# Altium project TestNumPad_r1.PrjPCB
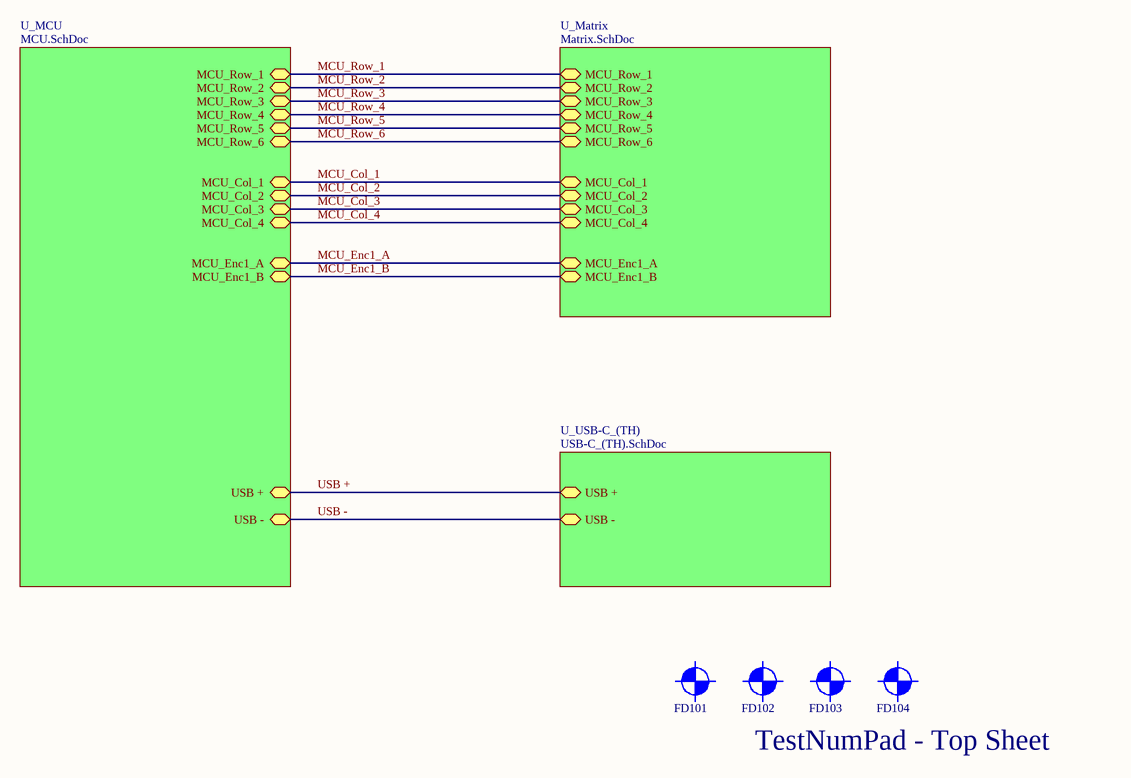
[diagram p0: Top Sheet.SchDoc]
DrawnBy: JimBobJones; Rev: r1
4 sheets, 98 parts. Net scope: hierarchical (ports join the sheet entries above them; power ports are global).
Board file: TestNumPad_r1.PcbDoc
Sheets:
  Top Sheet.SchDoc
    U_MCU = MCU.SchDoc
    U_Matrix = Matrix.SchDoc
    U_USB-C_(TH) = USB-C_(TH).SchDoc

## Sheet Top Sheet.SchDoc
size A4; DrawnBy: JimBobJones; DocumentNumber: 1; SheetNumber: 1; SheetTotal: 4

### Parts
FD101  Fiducial  [Fiducial]  (value not drawn)  (no BOM)
FD102  Fiducial  [Fiducial]  (value not drawn)  (no BOM)
FD103  Fiducial  [Fiducial]  (value not drawn)  (no BOM)
FD104  Fiducial  [Fiducial]  (value not drawn)  (no BOM)

### Sub-sheets
U_Matrix = Matrix.SchDoc: MCU_Row_1 (bidir), MCU_Row_2 (bidir), MCU_Row_3 (bidir), MCU_Row_4 (bidir), MCU_Row_5 (bidir), MCU_Row_6 (bidir), MCU_Col_1 (bidir), MCU_Col_2 (bidir), MCU_Col_3 (bidir), MCU_Col_4 (bidir), MCU_Enc1_A (bidir), MCU_Enc1_B (bidir)
U_MCU = MCU.SchDoc: MCU_Row_1 (bidir), MCU_Row_2 (bidir), MCU_Row_3 (bidir), MCU_Row_4 (bidir), MCU_Row_5 (bidir), MCU_Row_6 (bidir), MCU_Col_1 (bidir), MCU_Col_2 (bidir), MCU_Col_3 (bidir), MCU_Col_4 (bidir), MCU_Enc1_A (bidir), MCU_Enc1_B (bidir), USB - (bidir), USB + (bidir)
U_USB-C_(TH) = USB-C_(TH).SchDoc: USB - (bidir), USB + (bidir)

### Nets
MCU_Col_1: sheet U_MCU/MCU_Col_1, sheet U_Matrix/MCU_Col_1
MCU_Col_2: sheet U_MCU/MCU_Col_2, sheet U_Matrix/MCU_Col_2
MCU_Col_3: sheet U_MCU/MCU_Col_3, sheet U_Matrix/MCU_Col_3
MCU_Col_4: sheet U_MCU/MCU_Col_4, sheet U_Matrix/MCU_Col_4
MCU_Enc1_A: sheet U_MCU/MCU_Enc1_A, sheet U_Matrix/MCU_Enc1_A
MCU_Enc1_B: sheet U_MCU/MCU_Enc1_B, sheet U_Matrix/MCU_Enc1_B
MCU_Row_1: sheet U_MCU/MCU_Row_1, sheet U_Matrix/MCU_Row_1
MCU_Row_2: sheet U_MCU/MCU_Row_2, sheet U_Matrix/MCU_Row_2
MCU_Row_3: sheet U_MCU/MCU_Row_3, sheet U_Matrix/MCU_Row_3
MCU_Row_4: sheet U_MCU/MCU_Row_4, sheet U_Matrix/MCU_Row_4
MCU_Row_5: sheet U_MCU/MCU_Row_5, sheet U_Matrix/MCU_Row_5
MCU_Row_6: sheet U_MCU/MCU_Row_6, sheet U_Matrix/MCU_Row_6
USB +: sheet U_MCU/USB +, sheet U_USB-C_(TH)/USB +
USB -: sheet U_MCU/USB -, sheet U_USB-C_(TH)/USB -

### Notes on the sheet
- TestNumPad - Top Sheet

### Library data of the parts
FD101-FD104 = Fiducial: Fiducial Mark

## Sheet MCU.SchDoc
size A3; DrawnBy: JimBobJones; DocumentNumber: 3; SheetNumber: 3; SheetTotal: 4
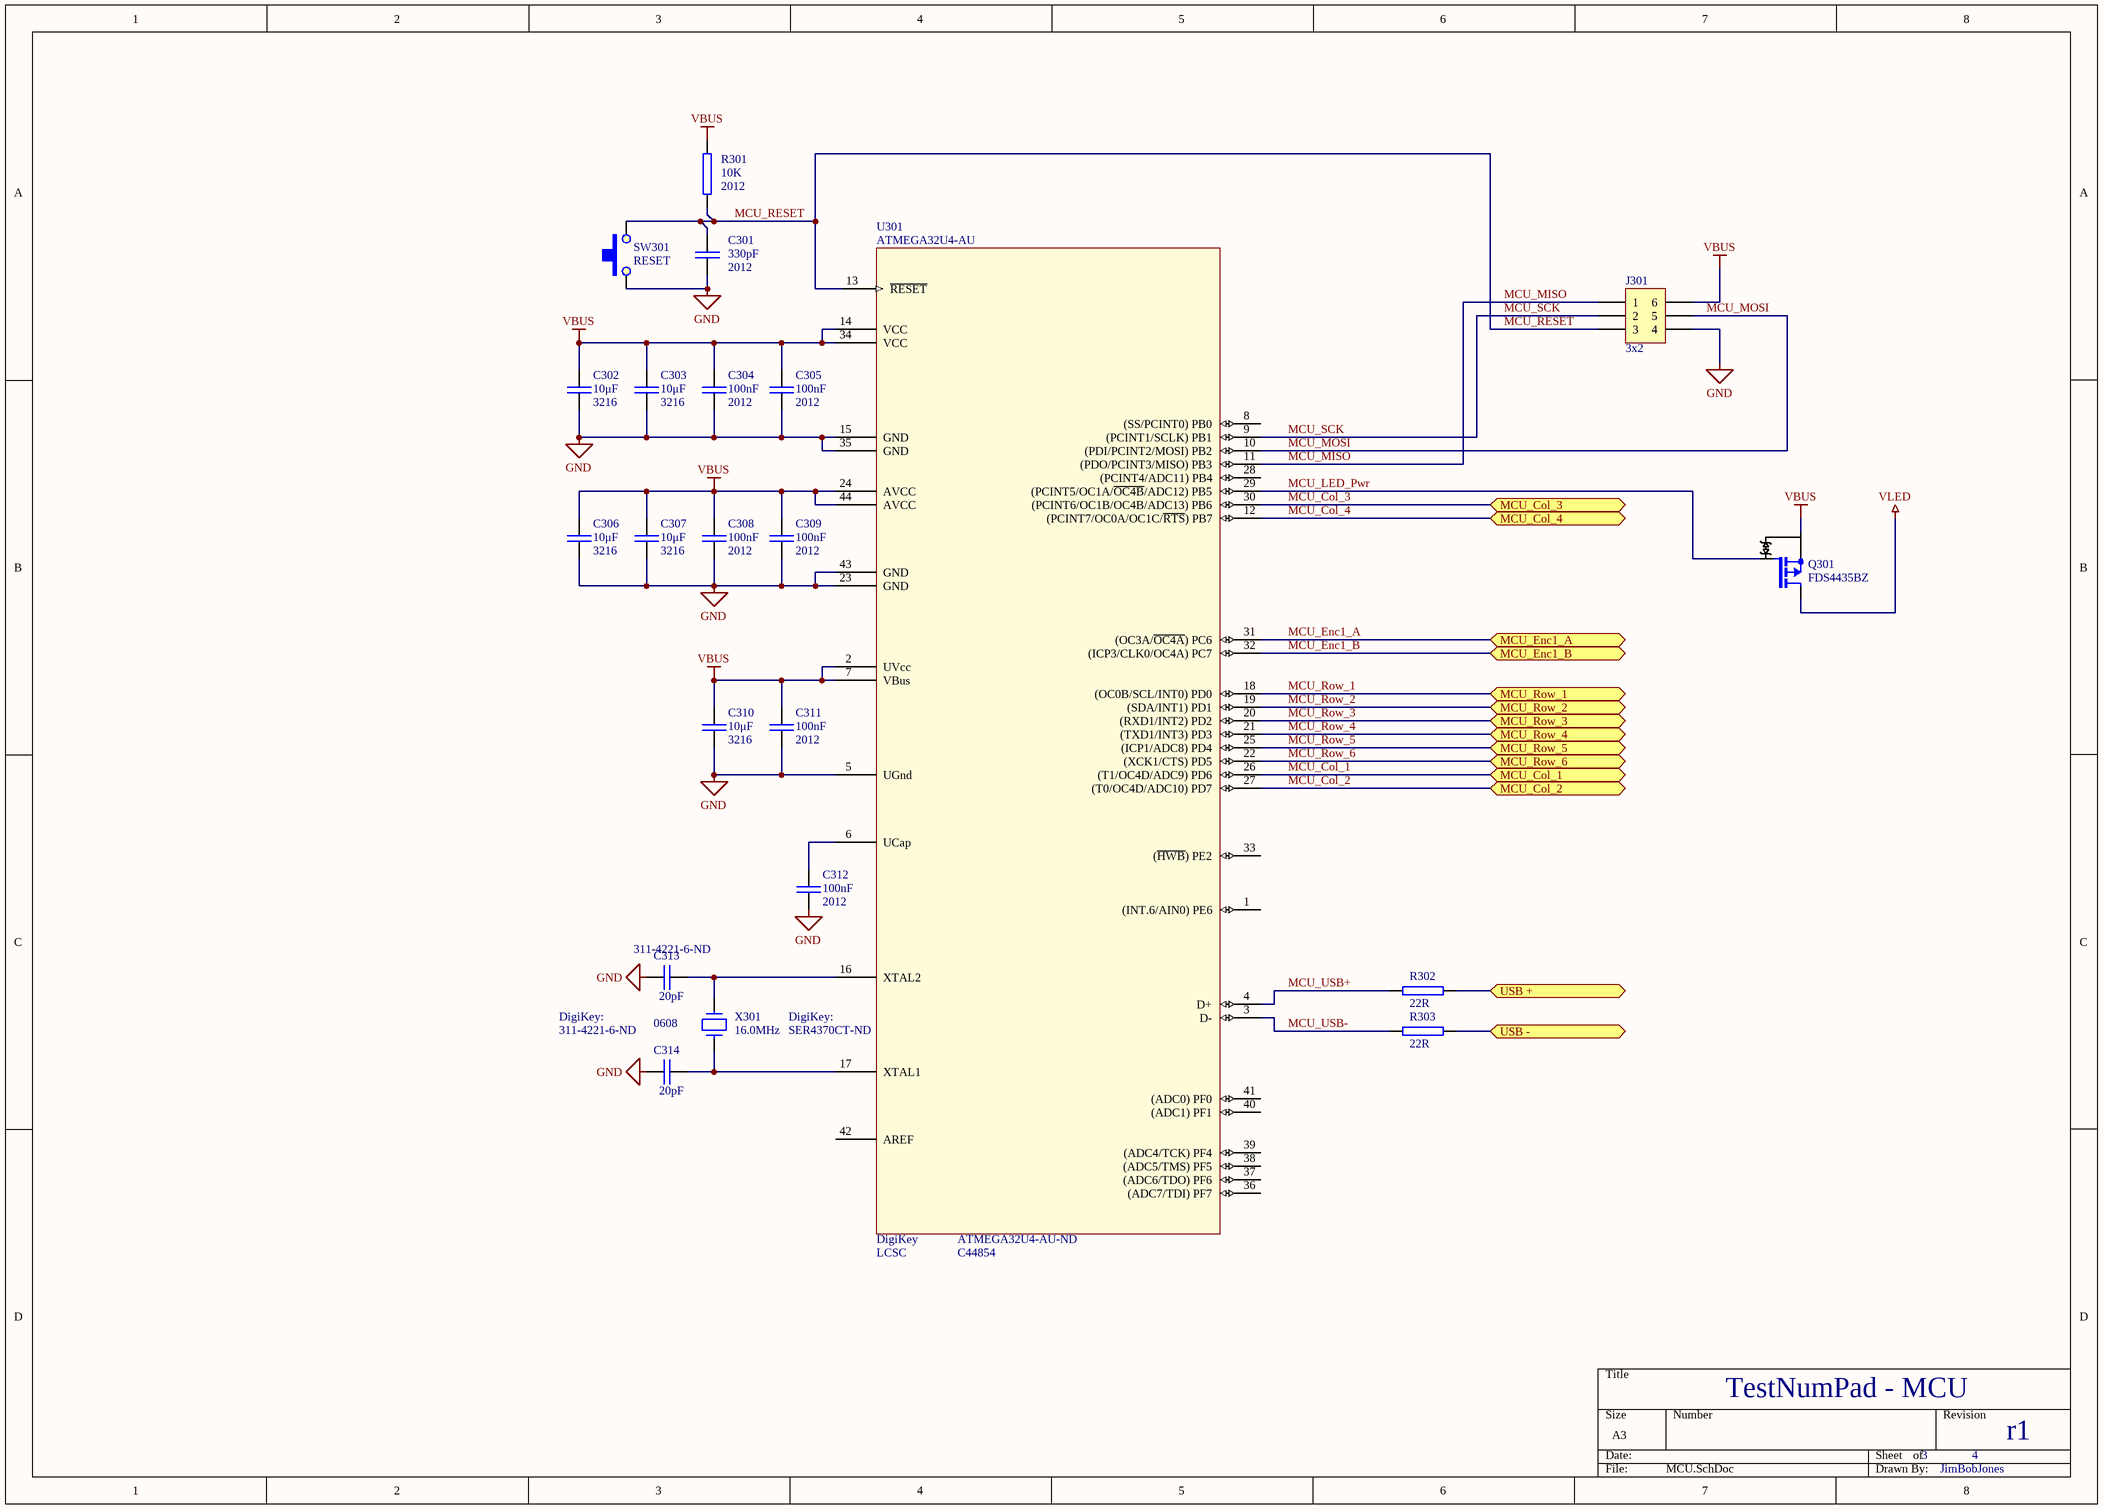
[diagram p1: MCU.SchDoc]

### Parts
C301  330pF  [2012C (0805)]
C302  10μF  [3216C (1206)]
C303  10μF  [3216C (1206)]
C304  100nF  [2012C (0805)]
C305  100nF  [2012C (0805)]
C306  10μF  [3216C (1206)]
C307  10μF  [3216C (1206)]
C308  100nF  [2012C (0805)]
C309  100nF  [2012C (0805)]
C310  10μF  [3216C (1206)]
C311  100nF  [2012C (0805)]
C312  100nF  [2012C (0805)]
C313  20pF  Supplier Part Number 1: 311-4221-6-ND  [1608C (0603)]
C314  20pF  Supplier Part Number 1: 311-4221-6-ND  [1608C (0603)]
J301  3x2  [Header-3x2-NoMod]
Q301  FDS4435BZ  [SO8-150/200mil-GDS]
R301  10K  [2012R-10K]
R302  22R  [2012R-22]
R303  22R  [2012R-22]
SW301  RESET  [SW_PB6x6]
U301  ATMEGA32U4-AU  Supplier Part Number 1: C44854  Supplier Part Number 2: ATMEGA32U4-AU-ND  [TQFP-44-0.8]
X301  16.0MHz  Supplier Part Number 1: SER4370CT-ND  [Crystal_4-SMD]

### Ports
MCU_Col_1 (bidir), MCU_Col_2 (bidir), MCU_Col_3 (bidir), MCU_Col_4 (bidir), MCU_Enc1_A (bidir), MCU_Enc1_B (bidir), MCU_Row_1 (bidir), MCU_Row_2 (bidir), MCU_Row_3 (bidir), MCU_Row_4 (bidir), MCU_Row_5 (bidir), MCU_Row_6 (bidir), USB + (bidir), USB - (bidir)

### Nets
GND: C301.2 C302.2 C303.2 C304.2 C305.2 C306.2 C307.2 C308.2 C309.2 C310.2 C311.2 C312.2 C313.1 C314.1 J301.4 SW301.1(COM) U301.5(UGnd) U301.15(GND) U301.23(GND) U301.35(GND) U301.43(GND)
VBUS: C302.1 C303.1 C304.1 C305.1 C306.1 C307.1 C308.1 C309.1 C310.1 C311.1 J301.6 Q301.S R301.1 U301.2(UVcc) U301.7(VBus) U301.14(VCC) U301.24(AVCC) U301.34(VCC) U301.44(AVCC)
VLED: Q301.D
MCU_Col_1: U301.26((T1/OC4D/ADC9)_PD6) ; port MCU_Col_1
MCU_Col_2: U301.27((T0/OC4D/ADC10)_PD7) ; port MCU_Col_2
MCU_Col_3: U301.30((PCINT6/OC1B/OC4B/ADC13)_PB6) ; port MCU_Col_3
MCU_Col_4: U301.12((PCINT7/OC0A/OC1C/~{RTS})_PB7) ; port MCU_Col_4
MCU_Enc1_A: U301.31((OC3A/~{OC4A})_PC6) ; port MCU_Enc1_A
MCU_Enc1_B: U301.32((ICP3/CLK0/OC4A)_PC7) ; port MCU_Enc1_B
MCU_LED_Pwr: Q301.G U301.29((PCINT5/OC1A/~{OC4B}/ADC12)_PB5)
MCU_MISO: J301.1 U301.11((PDO/PCINT3/MISO)_PB3)
MCU_MOSI: J301.5 U301.10((PDI/PCINT2/MOSI)_PB2)
MCU_RESET: C301.1 J301.3 R301.2 SW301.3(COM) U301.13(~{RESET})
MCU_Row_1: U301.18((OC0B/SCL/INT0)_PD0) ; port MCU_Row_1
MCU_Row_2: U301.19((SDA/INT1)_PD1) ; port MCU_Row_2
MCU_Row_3: U301.20((RXD1/INT2)_PD2) ; port MCU_Row_3
MCU_Row_4: U301.21((TXD1/INT3)_PD3) ; port MCU_Row_4
MCU_Row_5: U301.25((ICP1/ADC8)_PD4) ; port MCU_Row_5
MCU_Row_6: U301.22((XCK1/CTS)_PD5) ; port MCU_Row_6
MCU_SCK: J301.2 U301.9((PCINT1/SCLK)_PB1)
MCU_USB+: R302.1 U301.4(D+)
MCU_USB-: R303.1 U301.3(D-)
USB +: R302.2 ; port USB +
USB -: R303.2 ; port USB -
NetC312_1: C312.1 U301.6(UCap)
NetC313_2: C313.2 U301.16(XTAL2) X301.3
NetC314_2: C314.2 U301.17(XTAL1) X301.1

Not connected (* = marked no-connect by the designer): U301 1((INT.6/AIN0)_PE6) 8((SS/PCINT0)_PB0) 28((PCINT4/ADC11)_PB4) 33((~{HWB})_PE2) 36((ADC7/TDI)_PF7) 37((ADC6/TDO)_PF6) 38((ADC5/TMS)_PF5) 39((ADC4/TCK)_PF4) 40((ADC1)_PF1) 41((ADC0)_PF0) 42(AREF)

### Notes on the sheet
- (near R301) 2012
- (near C301) 2012
- (near C302) 3216
- (near C303) 3216
- (near C304) 2012
- (near C305) 2012
- (near C306) 3216
- (near C307) 3216
- (near C308) 2012
- (near C309) 2012
- (near C310) 3216
- (near C311) 2012
- (near C312) 2012
- DigiKey:
- 0608
- (near U301) DigiKey:
- (near U301) DigiKey
- LCSC
- TestNumPad - MCU

### Library data of the parts
C301 = 2012C-330pF (NPO): Capacitor MLCC 50V C0G (NP0) ±10%
C302 C303 C306 C307 C310 = 3216C-10uF: 3216, 25V MLCC X5R CAPACITOR
C304 C305 C308 C309 C311 C312 = 2012C-100nF: 2012 100nF MLCC Capacitor 50V X7R
C313 C314 = 1608C-20pF (NPO): Capacitor MLCC 50V C0G (NP0) ±10%; Supplier 1: Digi-Key
J301 = Header 3x2: 0.1 inch, 3 Pin Receptacle, 2 Row
Q301 = FDS4435BZ: P-channel, 30V, 3.2A, 120-75mOhm Enhancement MOSFET with 3.8Kv ESD Protection
R301 = 2012R-10K: RESISTOR 2012 1/4 WATT THIN FILM; Reel: *
R302 R303 = 2012R-22: RESISTOR 2012 1/4 WATT THIN FILM; Reel: *
SW301 = SWITCH_SPST_PUSH-6mm: 6mm, SPST Tact switch (DPST Only 1 Contact Used)
U301 = ATMEGA32U4-AU: Atmel ATMEGA Series Microcontroller, 16MHz, 32KB, 2.56KB Ram, 1KB EEPROM, 44 Pin, 26 IO, 2.7V-5.5V, TQFP-44; Supplier 1: LCSC; Supplier 2: Digi-Key
X301 = Crystal-16M: 16MHz Crystal, 16pF, 60R ESR; Supplier 1: Digi-Key

## Sheet Matrix.SchDoc
size A3; DrawnBy: JimBobJones; DocumentNumber: 2; SheetNumber: 2; SheetTotal: 4
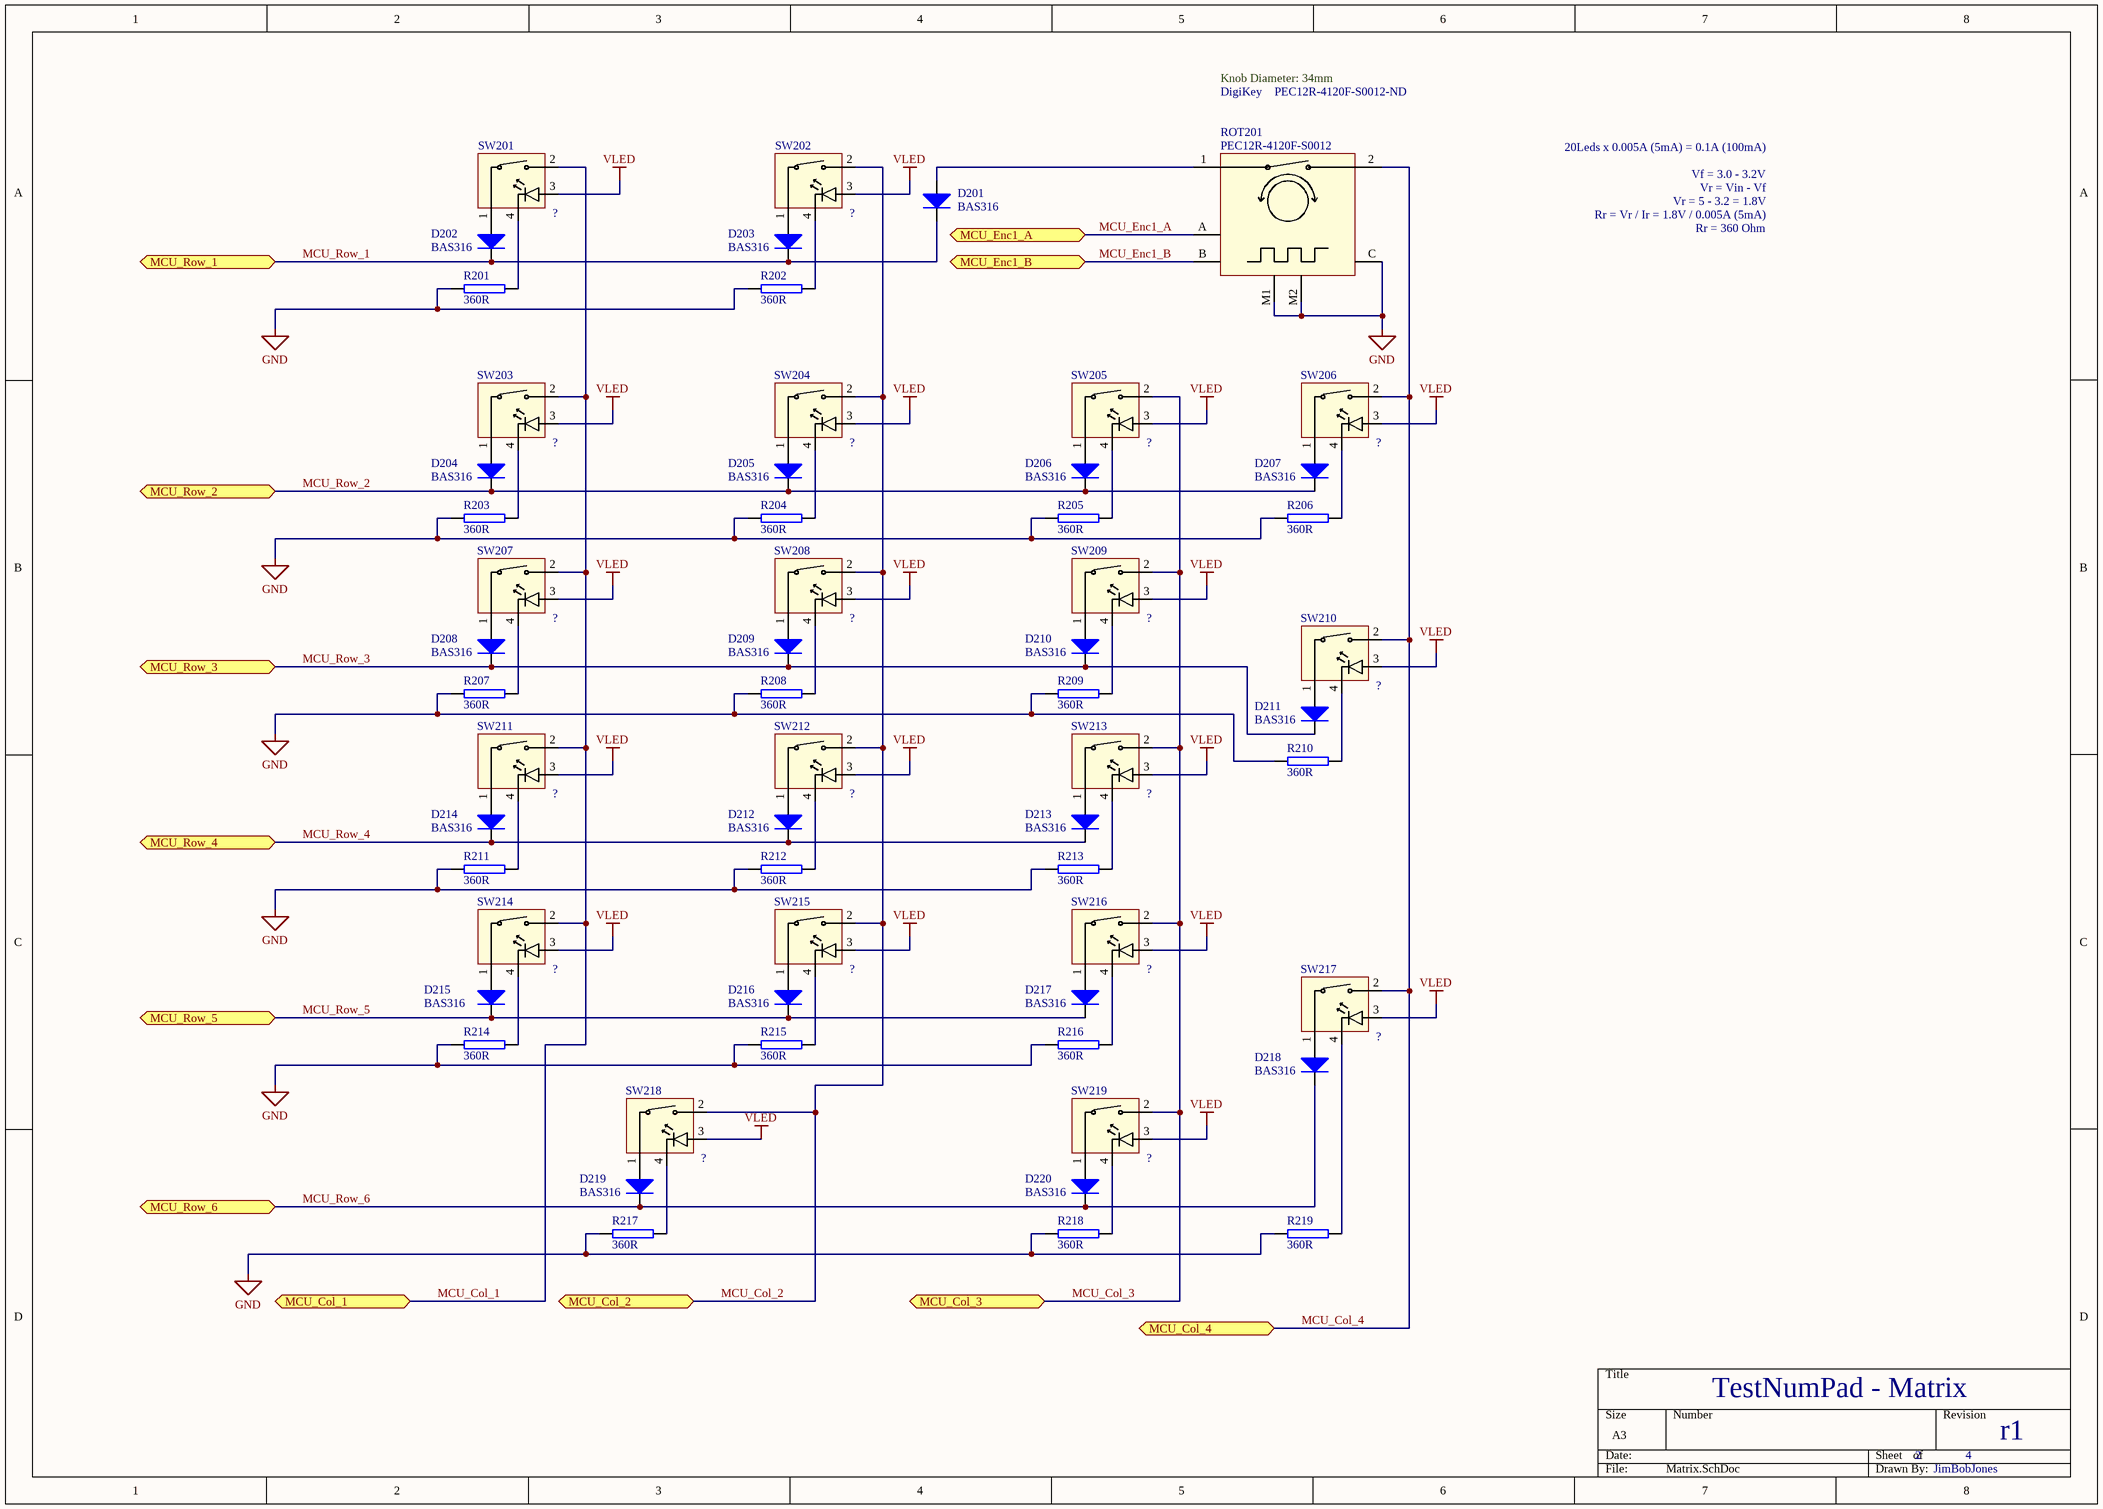
[diagram p2: Matrix.SchDoc]

### Parts
D201  BAS316  [SOD110/SOD323]
D202  BAS316  [SOD110/SOD323]
D203  BAS316  [SOD110/SOD323]
D204  BAS316  [SOD110/SOD323]
D205  BAS316  [SOD110/SOD323]
D206  BAS316  [SOD110/SOD323]
D207  BAS316  [SOD110/SOD323]
D208  BAS316  [SOD110/SOD323]
D209  BAS316  [SOD110/SOD323]
D210  BAS316  [SOD110/SOD323]
D211  BAS316  [SOD110/SOD323]
D212  BAS316  [SOD110/SOD323]
D213  BAS316  [SOD110/SOD323]
D214  BAS316  [SOD110/SOD323]
D215  BAS316  [SOD110/SOD323]
D216  BAS316  [SOD110/SOD323]
D217  BAS316  [SOD110/SOD323]
D218  BAS316  [SOD110/SOD323]
D219  BAS316  [SOD110/SOD323]
D220  BAS316  [SOD110/SOD323]
R201  360R  [2012R-360]
R202  360R  [2012R-360]
R203  360R  [2012R-360]
R204  360R  [2012R-360]
R205  360R  [2012R-360]
R206  360R  [2012R-360]
R207  360R  [2012R-360]
R208  360R  [2012R-360]
R209  360R  [2012R-360]
R210  360R  [2012R-360]
R211  360R  [2012R-360]
R212  360R  [2012R-360]
R213  360R  [2012R-360]
R214  360R  [2012R-360]
R215  360R  [2012R-360]
R216  360R  [2012R-360]
R217  360R  [2012R-360]
R218  360R  [2012R-360]
R219  360R  [2012R-360]
ROT201  PEC12R-4120F-S0012  Supplier Part Number 1: PEC12R-4120F-S0012-ND  [PEC12R-4xxxF-Sxxxx-NoMod]
SW201  MX_Apls  [MX-1U]  (value not drawn)
SW202  MX_Apls  [MX-1U]  (value not drawn)
SW203  MX_Apls  [MX-1U]  (value not drawn)
SW204  MX_Apls  [MX-1U]  (value not drawn)
SW205  MX_Apls  [MX-1U]  (value not drawn)
SW206  MX_Apls  [MX-1U]  (value not drawn)
SW207  MX_Apls  [MX-1U]  (value not drawn)
SW208  MX_Apls  [MX-1U]  (value not drawn)
SW209  MX_Apls  [MX-1U]  (value not drawn)
SW210  MX_Apls  [MX-2U]  (value not drawn)
SW211  MX_Apls  [MX-1U]  (value not drawn)
SW212  MX_Apls  [MX-1U]  (value not drawn)
SW213  MX_Apls  [MX-1U]  (value not drawn)
SW214  MX_Apls  [MX-1U]  (value not drawn)
SW215  MX_Apls  [MX-1U]  (value not drawn)
SW216  MX_Apls  [MX-1U]  (value not drawn)
SW217  MX_Apls  [MX-2U]  (value not drawn)
SW218  MX_Apls  [MX-2U]  (value not drawn)
SW219  MX_Apls  [MX-1U]  (value not drawn)

### Ports
MCU_Col_1 (bidir), MCU_Col_2 (bidir), MCU_Col_3 (bidir), MCU_Col_4 (bidir), MCU_Enc1_A (bidir), MCU_Enc1_B (bidir), MCU_Row_1 (bidir), MCU_Row_2 (bidir), MCU_Row_3 (bidir), MCU_Row_4 (bidir), MCU_Row_5 (bidir), MCU_Row_6 (bidir)

### Nets
GND: R201.2 R202.2 R203.1 R204.1 R205.1 R206.1 R207.1 R208.1 R209.1 R210.1 R211.1 R212.1 R213.1 R214.1 R215.1 R216.1 R217.1 R218.1 R219.1 ROT201.C ROT201.M1(M) ROT201.M2
VLED: SW201.3 SW202.3 SW203.3 SW204.3 SW205.3 SW206.3 SW207.3 SW208.3 SW209.3 SW210.3 SW211.3 SW212.3 SW213.3 SW214.3 SW215.3 SW216.3 SW217.3 SW218.3 SW219.3
MCU_Col_1: SW201.2 SW203.2 SW207.2 SW211.2 SW214.2 ; port MCU_Col_1
MCU_Col_2: SW202.2 SW204.2 SW208.2 SW212.2 SW215.2 SW218.2 ; port MCU_Col_2
MCU_Col_3: SW205.2 SW209.2 SW213.2 SW216.2 SW219.2 ; port MCU_Col_3
MCU_Col_4: ROT201.2 SW206.2 SW210.2 SW217.2 ; port MCU_Col_4
MCU_Enc1_A: ROT201.A ; port MCU_Enc1_A
MCU_Enc1_B: ROT201.B ; port MCU_Enc1_B
MCU_Row_1: D201.K(-) D202.K(-) D203.K(-) ; port MCU_Row_1
MCU_Row_2: D204.K(-) D205.K(-) D206.K(-) D207.K(-) ; port MCU_Row_2
MCU_Row_3: D208.K(-) D209.K(-) D210.K(-) D211.K(-) ; port MCU_Row_3
MCU_Row_4: D212.K(-) D213.K(-) D214.K(-) ; port MCU_Row_4
MCU_Row_5: D215.K(-) D216.K(-) D217.K(-) ; port MCU_Row_5
MCU_Row_6: D218.K(-) D219.K(-) D220.K(-) ; port MCU_Row_6
NetD201_A: D201.A(+) ROT201.1
NetD202_A: D202.A(+) SW201.1
NetD203_A: D203.A(+) SW202.1
NetD204_A: D204.A(+) SW203.1
NetD205_A: D205.A(+) SW204.1
NetD206_A: D206.A(+) SW205.1
NetD207_A: D207.A(+) SW206.1
NetD208_A: D208.A(+) SW207.1
NetD209_A: D209.A(+) SW208.1
NetD210_A: D210.A(+) SW209.1
NetD211_A: D211.A(+) SW210.1
NetD212_A: D212.A(+) SW212.1
NetD213_A: D213.A(+) SW213.1
NetD214_A: D214.A(+) SW211.1
NetD215_A: D215.A(+) SW214.1
NetD216_A: D216.A(+) SW215.1
NetD217_A: D217.A(+) SW216.1
NetD218_A: D218.A(+) SW217.1
NetD219_A: D219.A(+) SW218.1
NetD220_A: D220.A(+) SW219.1
NetR201_1: R201.1 SW201.4
NetR202_1: R202.1 SW202.4
NetR203_2: R203.2 SW203.4
NetR204_2: R204.2 SW204.4
NetR205_2: R205.2 SW205.4
NetR206_2: R206.2 SW206.4
NetR207_2: R207.2 SW207.4
NetR208_2: R208.2 SW208.4
NetR209_2: R209.2 SW209.4
NetR210_2: R210.2 SW210.4
NetR211_2: R211.2 SW211.4
NetR212_2: R212.2 SW212.4
NetR213_2: R213.2 SW213.4
NetR214_2: R214.2 SW214.4
NetR215_2: R215.2 SW215.4
NetR216_2: R216.2 SW216.4
NetR217_2: R217.2 SW218.4
NetR218_2: R218.2 SW219.4
NetR219_2: R219.2 SW217.4

### Notes on the sheet
- DigiKey
- Knob Diameter: 34mm
- Vf = 3.0 - 3.2V
- Vr = Vin - Vf
- 20Leds x 0.005A (5mA) = 0.1A (100mA)
- Vr = 5 - 3.2 = 1.8V
- Rr = Vr / Ir = 1.8V / 0.005A (5mA)
- Rr = 360 Ohm
- TestNumPad - Matrix

### Library data of the parts
D201-D220 = Diode-BAS316: Signal diode, 100V, 250mA, 400mW
R201-R219 = 2012R-360: RESISTOR 2012 1/4 WATT THIN FILM; Reel: *
ROT201 = PEC12R-Vert-Sw: Burns 6mm D-shaft 2-Ch Rotary Encoder with switch, 12ppr, Vertical; Supplier 1: Digi-Key
SW201-SW219 = MX-LED-1U: 1U - MX_Alps Hybrid Footprint; Key: ?

## Sheet USB-C_(TH).SchDoc
size A4; DrawnBy: JimBobJones; DocumentNumber: 4; SheetNumber: 4; SheetTotal: 4
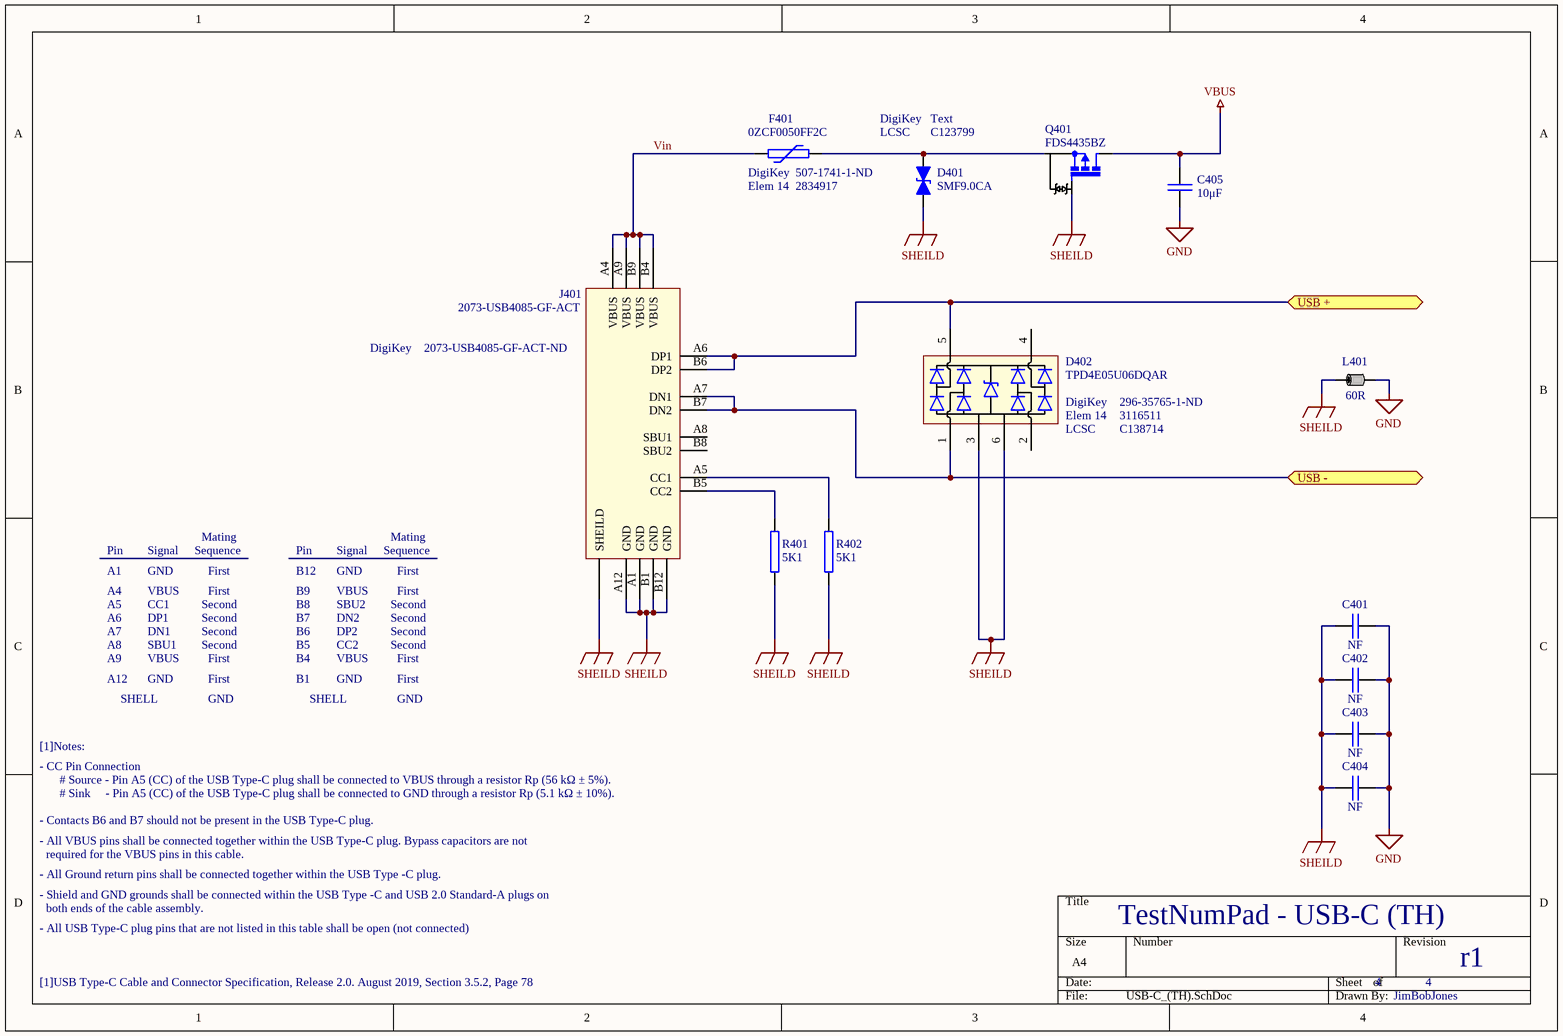
[diagram p3: USB-C_(TH).SchDoc]

### Parts
C401  NF  [2012C (0805)]
C402  NF  [2012C (0805)]
C403  NF  [2012C (0805)]
C404  NF  [2012C (0805)]
C405  10μF  [3216C (1206)]
D401  SMF9.0CA  [SOD-123FL]
D402  TPD4E05U06DQAR  [USON-10]
F401  0ZCF0050FF2C  Supplier Part Number 1: 507-1741-1-ND  Supplier Part Number 2: 2834917  [7351 (2920)]
J401  2073-USB4085-GF-ACT  Supplier Part Number 1: 2073-USB4085-GF-ACT-ND  [USB-C (2.0,TH)]
L401  60R  [3216 (1206)]
Q401  FDS4435BZ  [SO8-150/200mil-GDS]
R401  5K1  [2012R-5K1]
R402  5K1  [2012R-5K1]

### Ports
USB + (bidir), USB - (bidir)

### Nets
GND: C401.2 C402.2 C403.2 C404.2 C405.2 L401.2
SHEILD: C401.1 C402.1 C403.1 C404.1 D401.K D402.3 D402.6 J401.A1(GND) J401.A12(GND) J401.B1(GND) J401.B12(GND) J401.SHEILD L401.1 Q401.G R401.2 R402.2
VBUS: C405.1 Q401.D
USB +: D402.5 J401.A6(DP1) J401.B6(DP2) ; port USB +
USB -: D402.1 J401.A7(DN1) J401.B7(DN2) ; port USB -
Vin: F401.1 J401.A4(VBUS) J401.A9(VBUS) J401.B4(VBUS) J401.B9(VBUS)
NetD401_A: D401.A F401.2 Q401.S
NetJ401_A5: J401.A5(CC1) R402.1
NetJ401_B5: J401.B5(CC2) R401.1

Not connected (* = marked no-connect by the designer): D402 2 4; J401 A8(SBU1) B8(SBU2)

### Notes on the sheet
- (near F401) DigiKey
- (near D401) DigiKey
- (near D401) LCSC
- (near D401) Text
- (near D401) C123799
- (near F401) Elem 14
- DigiKey
- (near D402) DigiKey
- (near D402) Elem 14
- (near D402) LCSC
- 296-35765-1-ND
- 3116511
- C138714
- Pin
- A1
- Signal
- GND
- Sequence
- Mating
- First
- B12
- A4
- A5
- A6
- A7
- A8
- VBUS
- CC1
- DP1
- DN1
- SBU1
- Second
- B9
- B8
- B7
- B6
- B5
- SBU2
- DN2
- DP2
- CC2
- A9
- A12
- SHELL
- B4
- B1
- [1]Notes:
- - CC Pin Connection
- # Source - Pin A5 (CC) of the USB Type-C plug shall be connected to VBUS through a resistor Rp (56 kΩ ± 5%).
- - Contacts B6 and B7 should not be present in the USB Type-C plug.
- - All VBUS pins shall be connected together within the USB Type-C plug. Bypass capacitors are not
- # Sink     - Pin A5 (CC) of the USB Type-C plug shall be connected to GND through a resistor Rp (5.1 kΩ ± 10%).
- - All Ground return pins shall be connected together within the USB Type -C plug.
- - Shield and GND grounds shall be connected within the USB Type -C and USB 2.0 Standard-A plugs on
- required for the VBUS pins in this cable.
- both ends of the cable assembly.
- [1]USB Type-C Cable and Connector Specification, Release 2.0. August 2019, Section 3.5.2, Page 78
- - All USB Type-C plug pins that are not listed in this table shall be open (not connected)
- TestNumPad - USB-C (TH)

### Library data of the parts
C401-C404 = 2012C-100nF: 2012 100nF MLCC Capacitor 50V X7R
C405 = 3216C-10uF: 3216, 25V MLCC X5R CAPACITOR
D401 = Diode-TVS-SMF9.0CA: Bi-Directional TVS Diode, Vbr 10V, Vcl 15.4V, 13A, 200W
D402 = Diode-ESD Array_1: TVS Array, Low Capacitance, ESD Protection, 4IO + Pwr, (<3.0pF)
F401 = Poly-miniSMDC150F: Ih-0.5A, It-1A, Im-100A, 60V POLYFUSE; Supplier 1: Digi-Key; Supplier 2: Element14
J401 = USB-C (2.0,TH): USB 2.0 Type-C Connector, 16 Pin, TH + TH Case; Supplier 1: Digi-Key
L401 = FERRITE BEAD: SMD Ferrite Bead
Q401 = FDS4435BZ: as Q301 on sheet MCU
R401 R402 = 2012R-5K1: RESISTOR 2012 1/4 WATT THIN FILM; Reel: *

## Nets that join several sheets
GND: MCU (21 pins), Matrix (22 pins), USB-C_(TH) (6 pins)
VBUS: MCU (19 pins), USB-C_(TH) (C405.1 Q401.D)
VLED: MCU (Q301.D), Matrix (19 pins)
MCU_Col_1: MCU (U301.26), Matrix (5 pins)
MCU_Col_2: MCU (U301.27), Matrix (6 pins)
MCU_Col_3: MCU (U301.30), Matrix (5 pins)
MCU_Col_4: MCU (U301.12), Matrix (ROT201.2 SW206.2 SW210.2 SW217.2)
MCU_Enc1_A: MCU (U301.31), Matrix (ROT201.A)
MCU_Enc1_B: MCU (U301.32), Matrix (ROT201.B)
MCU_Row_1: MCU (U301.18), Matrix (D201.K D202.K D203.K)
MCU_Row_2: MCU (U301.19), Matrix (D204.K D205.K D206.K D207.K)
MCU_Row_3: MCU (U301.20), Matrix (D208.K D209.K D210.K D211.K)
MCU_Row_4: MCU (U301.21), Matrix (D212.K D213.K D214.K)
MCU_Row_5: MCU (U301.25), Matrix (D215.K D216.K D217.K)
MCU_Row_6: MCU (U301.22), Matrix (D218.K D219.K D220.K)
USB +: MCU (R302.2), USB-C_(TH) (D402.5 J401.A6 J401.B6)
USB -: MCU (R303.2), USB-C_(TH) (D402.1 J401.A7 J401.B7)